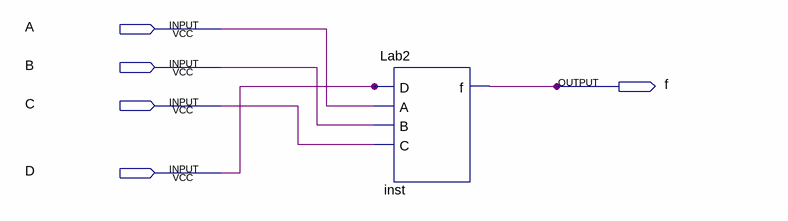
[diagram p0: schematic sheet]
// Quartus schematic Lab4DE1.bdf as structural Verilog: 1 symbols, 5 pins
module Lab4DE1 (
  input  A,
  input  B,
  input  C,
  input  D,
  output f
);

  Lab2 inst (.D(D), .A(A), .B(B), .C(C), .f(f));
endmodule
